# Altium schematic sheet schematic.SchDoc
size A; SheetNumber: 1; SheetTotal: 2
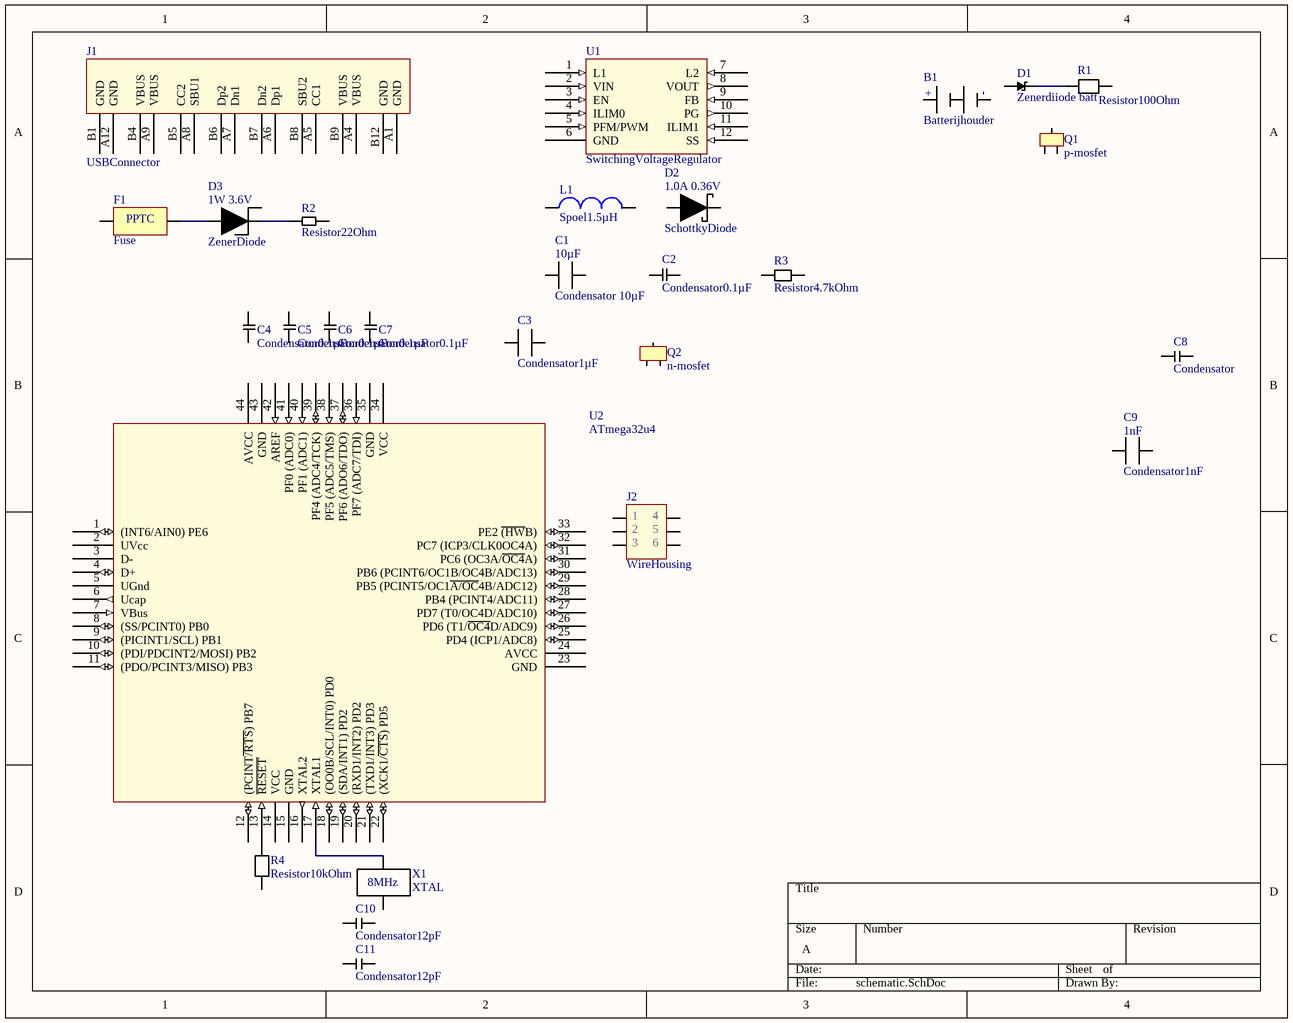
[diagram p0: schematic.SchDoc]

## Parts
B1  Batterijhouder
C1  Condensator 10µF  [CAPC0603X035M]
C2  Condensator0.1µF  [CAPC1210X70M]
C3  Condensator1µF  [CAPC1812X18M]
C4  Condensator0.1µF  [CAPC1210X70M]
C5  Condensator0.1µF  [CAPC1210X70M]
C6  Condensator0.1µF  [CAPC1210X70M]
C7  Condensator0.1µF  [CAPC1210X70M]
C8  Condensator  [CAPC1210X14M]
C9  Condensator1nF  [CAPC1206X18M]
C10  Condensator12pF  [CAPC1210X14M]
C11  Condensator12pF  [CAPC1210X14M]
D1  Zenerdiiode batt
D2  SchottkyDiode  [SDIODSMA1810X1M]
D3  ZenerDiode  [ZDIODSMA1810X2M]
F1  Fuse  [RESC4632X15M]
J1  USBConnector
J2  WireHousing
L1  Spoel1.5µH  [INDI0806X12M]
Q1  p-mosfet
Q2  n-mosfet
R1  Resistor100Ohm  [R1225X055M]
R2  Resistor22Ohm  [R0805X045M]
R3  Resistor4.7kOhm  [R1210X06M]
R4  Resistor10kOhm  [R1210X06M]
U1  SwitchingVoltageRegulator  [SON50P300X100_HS-11M]
U2  ATmega32u4  [TQFP80P1200X1200X100_HS-45N]
X1  XTAL  [CAPC13550X20N]

## Nets
NetD1_2: D1.2 R1.1
NetD3_1 (A): D3.1_(A) F1.2
NetD3_2 (C): D3.2_(C) R2.1
NetR4_2: R4.2 U2.13(~{RESET})
NetU2_17: U2.17(XTAL1) X1.1(Xtal_1)

Not connected (* = marked no-connect by the designer): B1 1 2(62); C1 1 2; C2 1 2; C3 1 2; C4 1 2; C5 1 2; C6 1 2; C7 1 2; C8 1 2; C9 1 2; C10 1 2; C11 1 2; D1 1; D2 1 (A) 2 (C); F1 1(____); J1 A1(GND) A4(VBUS) A5(CC1) A6(Dp1) A7(Dn1) A8(SBU1) A9(VBUS) A12(GND) B1(GND) B4(VBUS) B5(CC2) B6(Dp2) B7(Dn2) B8(SBU2) B9(VBUS) B12(GND); J2 ?1 ?2 ?3 ?4 ?5 ?6; L1 1 2; Q1 1(Gate) 2(Source) 3(__); Q2 1(Gate) 2(D) 3(Source); R1 2(__); R2 2; R3 1 2; R4 1; U1 1(L1) 2(VIN) 3(EN) 4(ILIM0) 5(PFM/PWM) 6(GND) 7(L2) 8(VOUT) 9(FB) 10(PG) 11(ILIM1) 12(SS); U2 1((INT6/AIN0)_PE6) 2(UVcc) 3(D-) 4(D+) 5(UGnd) 6(Ucap) 7(VBus) 8((SS/PCINT0)_PB0) 9((PICINT1/SCL)_PB1) 10((PDI/PDCINT2/MOSI)_PB2) 11((PDO/PCINT3/MISO)_PB3) 12((PCINT~{/RTS})_PB7) 14(VCC) 15(GND) 16(XTAL2) 18((OO0B/SCL/INT0)_PD0) 19((SDA/INT1)_PD2) 20((RXD1/INT2)_PD2) 21((TXD1/INT3)_PD3) 22((XCK1/~{CTS})_PD5) 23(GND) 24(AVCC) 25(PD4_(ICP1/ADC8)) 26(PD6_(T1/~{OC4}D/ADC9)) 27(PD7_(T0/OC4D/ADC10)) 28(PB4_(PCINT4/ADC11)) 29(PB5_(PCINT5/OC1~{A/OC}4B/ADC12)) 30(PB6_(PCINT6/OC1B/OC4B/ADC13)) 31(PC6_(OC3A/~{OC4}A)) 32(PC7_(ICP3/CLK0OC4A)) 33(PE2_~{(HW}B)) 34(VCC) 35(GND) 36(PF7_(ADC7/TDI)) 37(PF6_(ADO6/TDO)) 38(PF5_(ADC5/TMS)) 39(PF4_(ADC4/TCK)) 40(PF1_(ADC1)) 41(PF0_(ADC0)) 42(AREF) 43(GND) 44(AVCC); X1 2(Xtal__2)

## Notes on the sheet
- (in symbol Batterijhouder) -; +
- (in symbol Condensator1nF) 1nF
- (in symbol Condensator 10µF) 10µF
- (in symbol Fuse) PPTC
- (in symbol SchottkyDiode) 1.0A 0.36V
- (in symbol WireHousing) 1; 4; 2; 5; 3; 6
- (in symbol XTAL) 8MHz
- (in symbol ZenerDiode) 1W 3.6V

## Library data of the parts
C10 C11 = Condensator